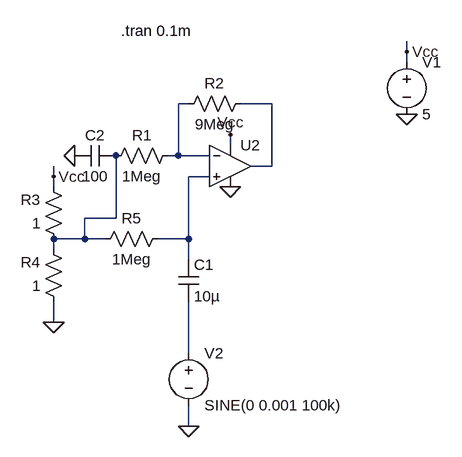
[diagram p0: schematic Draft2.asc]
Draft2.asc, the LTspice schematic file:
Version 4
SHEET 1 908 680
WIRE 848 80 848 64
WIRE 848 96 848 80
WIRE 512 160 496 160
WIRE 640 160 592 160
WIRE 576 224 576 208
WIRE 496 240 496 160
WIRE 496 240 480 240
WIRE 544 240 496 240
WIRE 640 256 640 160
WIRE 640 256 608 256
WIRE 304 272 304 256
WIRE 544 272 512 272
WIRE 304 288 304 272
WIRE 400 336 400 240
WIRE 400 336 352 336
WIRE 352 368 352 336
WIRE 352 368 304 368
WIRE 384 368 352 368
WIRE 512 368 512 272
WIRE 512 368 464 368
WIRE 304 384 304 368
WIRE 512 400 512 368
WIRE 304 496 304 464
WIRE 512 544 512 464
WIRE 512 656 512 624
FLAG 576 288 0
FLAG 336 240 0
FLAG 848 176 0
FLAG 848 80 Vcc
FLAG 576 208 Vcc
FLAG 304 496 0
FLAG 512 656 0
FLAG 304 272 Vcc
SYMBOL voltage 848 80 R0
SYMATTR InstName V1
SYMATTR Value 5
SYMBOL res 496 224 R90
WINDOW 0 0 56 VBottom 2
WINDOW 3 32 56 VTop 2
SYMATTR InstName R1
SYMATTR Value 1Meg
SYMBOL res 608 144 R90
WINDOW 0 0 56 VBottom 2
WINDOW 3 32 56 VTop 2
SYMATTR InstName R2
SYMATTR Value 9Meg
SYMBOL res 320 384 R180
WINDOW 0 36 76 Left 2
WINDOW 3 36 40 Left 2
SYMATTR InstName R3
SYMATTR Value 1
SYMBOL res 320 480 R180
WINDOW 0 36 76 Left 2
WINDOW 3 36 40 Left 2
SYMATTR InstName R4
SYMATTR Value 1
SYMBOL cap 496 400 R0
SYMATTR InstName C1
SYMATTR Value 10µ
SYMBOL res 480 352 R90
WINDOW 0 0 56 VBottom 2
WINDOW 3 32 56 VTop 2
SYMATTR InstName R5
SYMATTR Value 1Meg
SYMBOL voltage 512 528 R0
SYMATTR InstName V2
SYMATTR Value SINE(0 0.001 100k)
SYMBOL cap 400 224 R90
WINDOW 0 0 32 VBottom 2
WINDOW 3 32 32 VTop 2
SYMATTR InstName C2
SYMATTR Value 100
SYMBOL UniversalOpamp2 576 256 R0
SYMATTR InstName U2
TEXT 408 48 Left 2 !.tran 0.1m

The netlist it stands for:
* Draft2.asc
V1 Vcc 0 5
R1 N001 N004 1Meg
R2 N002 N001 9Meg
R3 N004 Vcc 1
R4 0 N004 1
C1 N003 N005 10µ
R5 N003 N004 1Meg
V2 N005 0 SINE(0 0.001 100k)
C2 N004 0 100
XU2 N003 N001 Vcc 0 N002 level.2 Avol=1Meg GBW=10Meg Slew=10Meg ilimit=25m rail=0 Vos=0 phimargin=45 en=0 enk=0 in=0 ink=0 Rin=500Meg  ; pins IN+ IN- V+ V- OUT
.tran 0.1m
.lib UniversalOpamps2.sub
.backanno
.end